# Altium schematic sheet ts.SchDoc
size A4
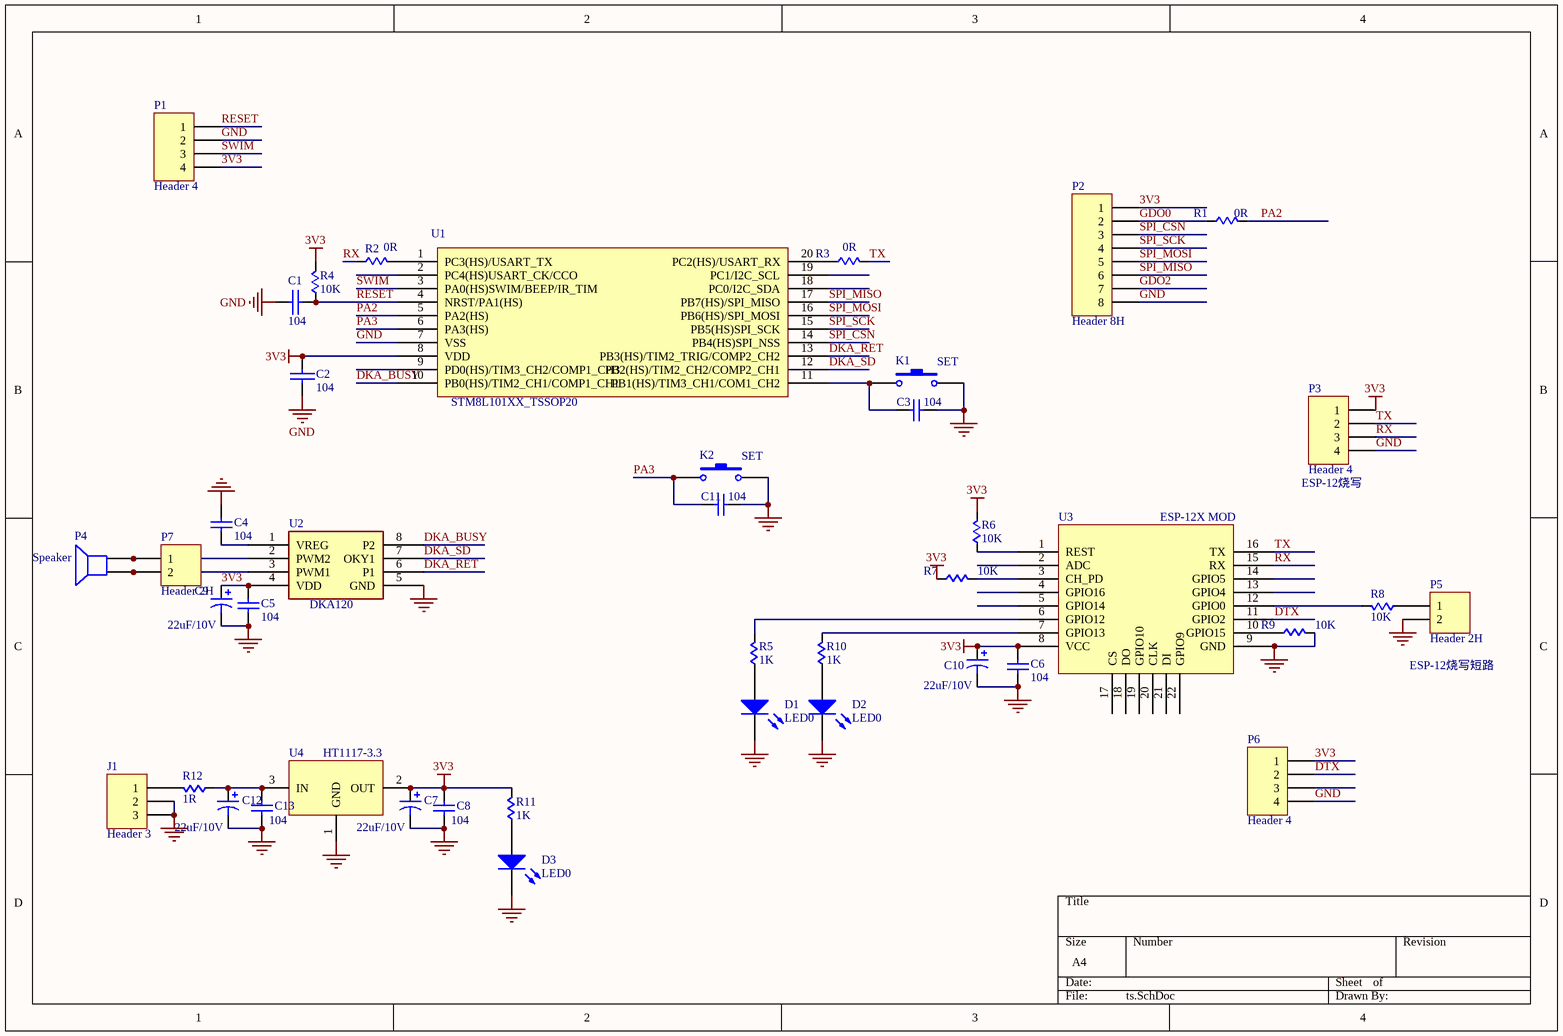
[diagram p0: ts.SchDoc]

## Parts
C1  104  [0603]
C2  104  [0603]
C3  104  [0603]
C4  104  [0603]
C5  104  [0603]
C6  104  [0603]
C7  value 22uF/10V  [T3528]  (hidden comment: 20uF/10V)
C8  104  [0603]
C9  value 22uF/10V  [T3528]  (hidden comment: 20uF/10V)
C10  value 22uF/10V  [T3528]  (hidden comment: 20uF/10V)
C11  104  [0603]
C12  value 22uF/10V  [T3528]  (hidden comment: 20uF/10V)
C13  104  [0603]
D1  LED0  [LED2]
D2  LED0  [LED2]
D3  LED0  [LED2]
J1  Header 3  [DC3.5]
K1  SET  [KEY_1]
K2  SET  [KEY_1]
P1  Header 4  [PIN4-2.0]
P2  Header 8H  [PIN 1.27*8]
P3  Header 4  [PIN4-2.0]
P4  Speaker  [J-2-50]
P5  Header 2H  [HDR1X2]
P6  Header 4  [PIN4-2.0]
P7  Header 2H  [HDR1X2]
R1  0R  [0603]
R2  0R  [0603]
R3  0R  [0603]
R4  10K  [0603]
R5  1K  [0603]
R6  10K  [0603]
R7  10K  [0603]
R8  10K  [0603]
R9  10K  [0603]
R10  1K  [0603]
R11  1K  [0603]
R12  1R  [0603]
U1  STM8L101XX_TSSOP20  [SSOP20]
U2  DKA120  [SO8(SOIC)]
U3  ESP-12X MOD  [ESP12]
U4  HT1117-3.3  [SOT-223]

## Nets
3V3: C2.2 C5.2 C6.2 C7.1 C8.1 C9.1 C10.1 P1.4 P2.1 P3.1 P6.1 R4.2 R6.2 R7.1 R11.2 U1.8(VDD) U2.4(VDD) U3.8(VCC) U4.2(OUT)
GND: C1.1 C2.1 C3.1 C4.2 C5.1 C6.1 C7.2 C8.2 C9.2 C10.2 C11.1 C12.2 C13.2 D1.2(K) D2.2(K) D3.2(K) J1.2 J1.3 K1.2 K2.2 P1.2 P2.8 P3.4 P5.2 P6.4 R9.2 U1.7(VSS) U2.5(GND) U3.9(GND) U4.1(GND)
DKA_BUSY: U1.10(PB0(HS)/TIM2_CH1/COMP1_CH1) U2.8(P2)
DKA_RET: U1.13(PB3(HS)/TIM2_TRIG/COMP2_CH2) U2.6(P1)
DKA_SD: U1.12(PB2(HS)/TIM2_CH2/COMP2_CH1) U2.7(OKY1)
DTX: P6.2 U3.11(GPIO2)
GDO0: P2.2 R1.1
GDO2: P2.7
PA2: R1.2 U1.5(PA2(HS))
PA3: C11.2 K2.1 U1.6(PA3(HS))
RESET: C1.2 P1.1 R4.1 U1.4(NRST/PA1(HS))
RX: P3.3 R2.2 U3.15(RX)
SPI_CSN: P2.3 U1.14(PB4(HS)SPI_NSS)
SPI_MISO: P2.6 U1.17(PB7(HS)/SPI_MISO)
SPI_MOSI: P2.5 U1.16(PB6(HS)/SPI_MOSI)
SPI_SCK: P2.4 U1.15(PB5(HS)SPI_SCK)
SWIM: P1.3 U1.3(PA0(HS)SWIM/BEEP/IR_TIM)
TX: P3.2 R3.2 U3.16(TX)
NetC3_2: C3.2 K1.1 U1.11(PB1(HS)/TIM3_CH1/COM1_CH2)
NetC4_1: C4.1 U2.1(VREG)
NetC12_1: C12.1 C13.1 R12.1 U4.3(IN)
NetD1_1: D1.1(A) R5.1
NetD2_1: D2.1(A) R10.1
NetD3_1: D3.1(A) R11.1
NetJ1_1: J1.1 R12.2
NetP4_1: P4.1 P7.2 U2.3(PWM1)
NetP4_2: P4.2 P7.1 U2.2(PWM2)
NetP5_1: P5.1 R8.1
NetR2_1: R2.1 U1.1(PC3(HS)/USART_TX)
NetR3_1: R3.1 U1.20(PC2(HS)/USART_RX)
NetR5_2: R5.2 U3.6(GPIO12)
NetR6_1: R6.1 U3.1(REST)
NetR7_2: R7.2 U3.3(CH_PD)
NetR8_2: R8.2 U3.12(GPIO0)
NetR9_1: R9.1 U3.10(GPIO15)
NetR10_2: R10.2 U3.7(GPIO13)

Not connected (* = marked no-connect by the designer): P6 3; U1 2(PC4(HS)USART_CK/CCO) 9(PD0(HS)/TIM3_CH2/COMP1_CH3) 18(PC0/I2C_SDA) 19(PC1/I2C_SCL); U3 2(ADC) 4(GPIO16) 5(GPIO14) 13(GPIO4) 14(GPIO5) 17(CS) 18(DO) 19(GPIO10) 20(CLK) 21(DI) 22(GPIO9)

## Notes on the sheet
- (near P3) ESP-12烧写
- ESP-12烧写短路

## Library data of the parts
C1 C2 = CAP: Capacitor
C3-C6 C8 C11 C13 = Cap Semi: Capacitor (Semiconductor SIM Model); Published: 8-Jun-2000; LatestRevisionDate: 29-May-2009; LatestRevisionNote: IPC-7351 Footprint Added.; PackageReference: C1206; Publisher: Altium Limited; PackageDescription: Chip Capacitor; Value: 104
C7 C9 C10 C12 = Cap Pol3: Polarized Capacitor (Surface Mount); Published: 8-Jun-2000; LatestRevisionDate: 29-May-2009; LatestRevisionNote: IPC-7351 Footprint Added.; PackageReference: C0805; Publisher: Altium Limited; PackageDescription: Chip Capacitor
D1-D3 = LED0: Typical INFRARED GaAs LED; Published: 8-Jun-2000; LatestRevisionDate: 08-Jul-2005; LatestRevisionNote: Mech Layer 1 removed.; PackageReference: LED-0; Publisher: Altium Limited
J1 = Header 3: Header, 3-Pin; LatestRevisionDate: 17-Jul-2002; LatestRevisionNote: Re-released for DXP Platform.; Publisher: Altium Limited
K1 K2 = SW-PB: Switch; Published: 24-Mar-1999; LatestRevisionDate: 17-Jul-2002; LatestRevisionNote: Re-released for DXP Platform.; PackageReference: SPST-2; Publisher: Altium Limited
P1 P3 P6 = Header 4: Header, 4-Pin; LatestRevisionDate: 17-Jul-2002; LatestRevisionNote: Re-released for DXP Platform.; Publisher: Altium Limited
P2 = Header 8H: Header, 8-Pin, Right Angle; LatestRevisionDate: 17-Jul-2002; LatestRevisionNote: Re-released for DXP Platform.; Publisher: Altium Limited
P4 = Speaker: Loudspeaker; Published: 24-Mar-1999; LatestRevisionDate: 17-Jul-2002; LatestRevisionNote: Re-released for DXP Platform.; PackageReference: PIN2; Publisher: Altium Limited
P5 P7 = Header 2H: Header, 2-Pin, Right Angle; LatestRevisionDate: 17-Jul-2002; LatestRevisionNote: Re-released for DXP Platform.; Publisher: Altium Limited
R1-R12 = RES-SM
  R1-R3: Value: 0R
  R4 R6-R9: Value: 10K
  R5 R10 R11: Value: 1K
  R12: Value: 1R
U1 = STM8L101
U3 = ESP8266 MOD